# Altium schematic sheet Cyusb3014 - 1.SchDoc
size A3
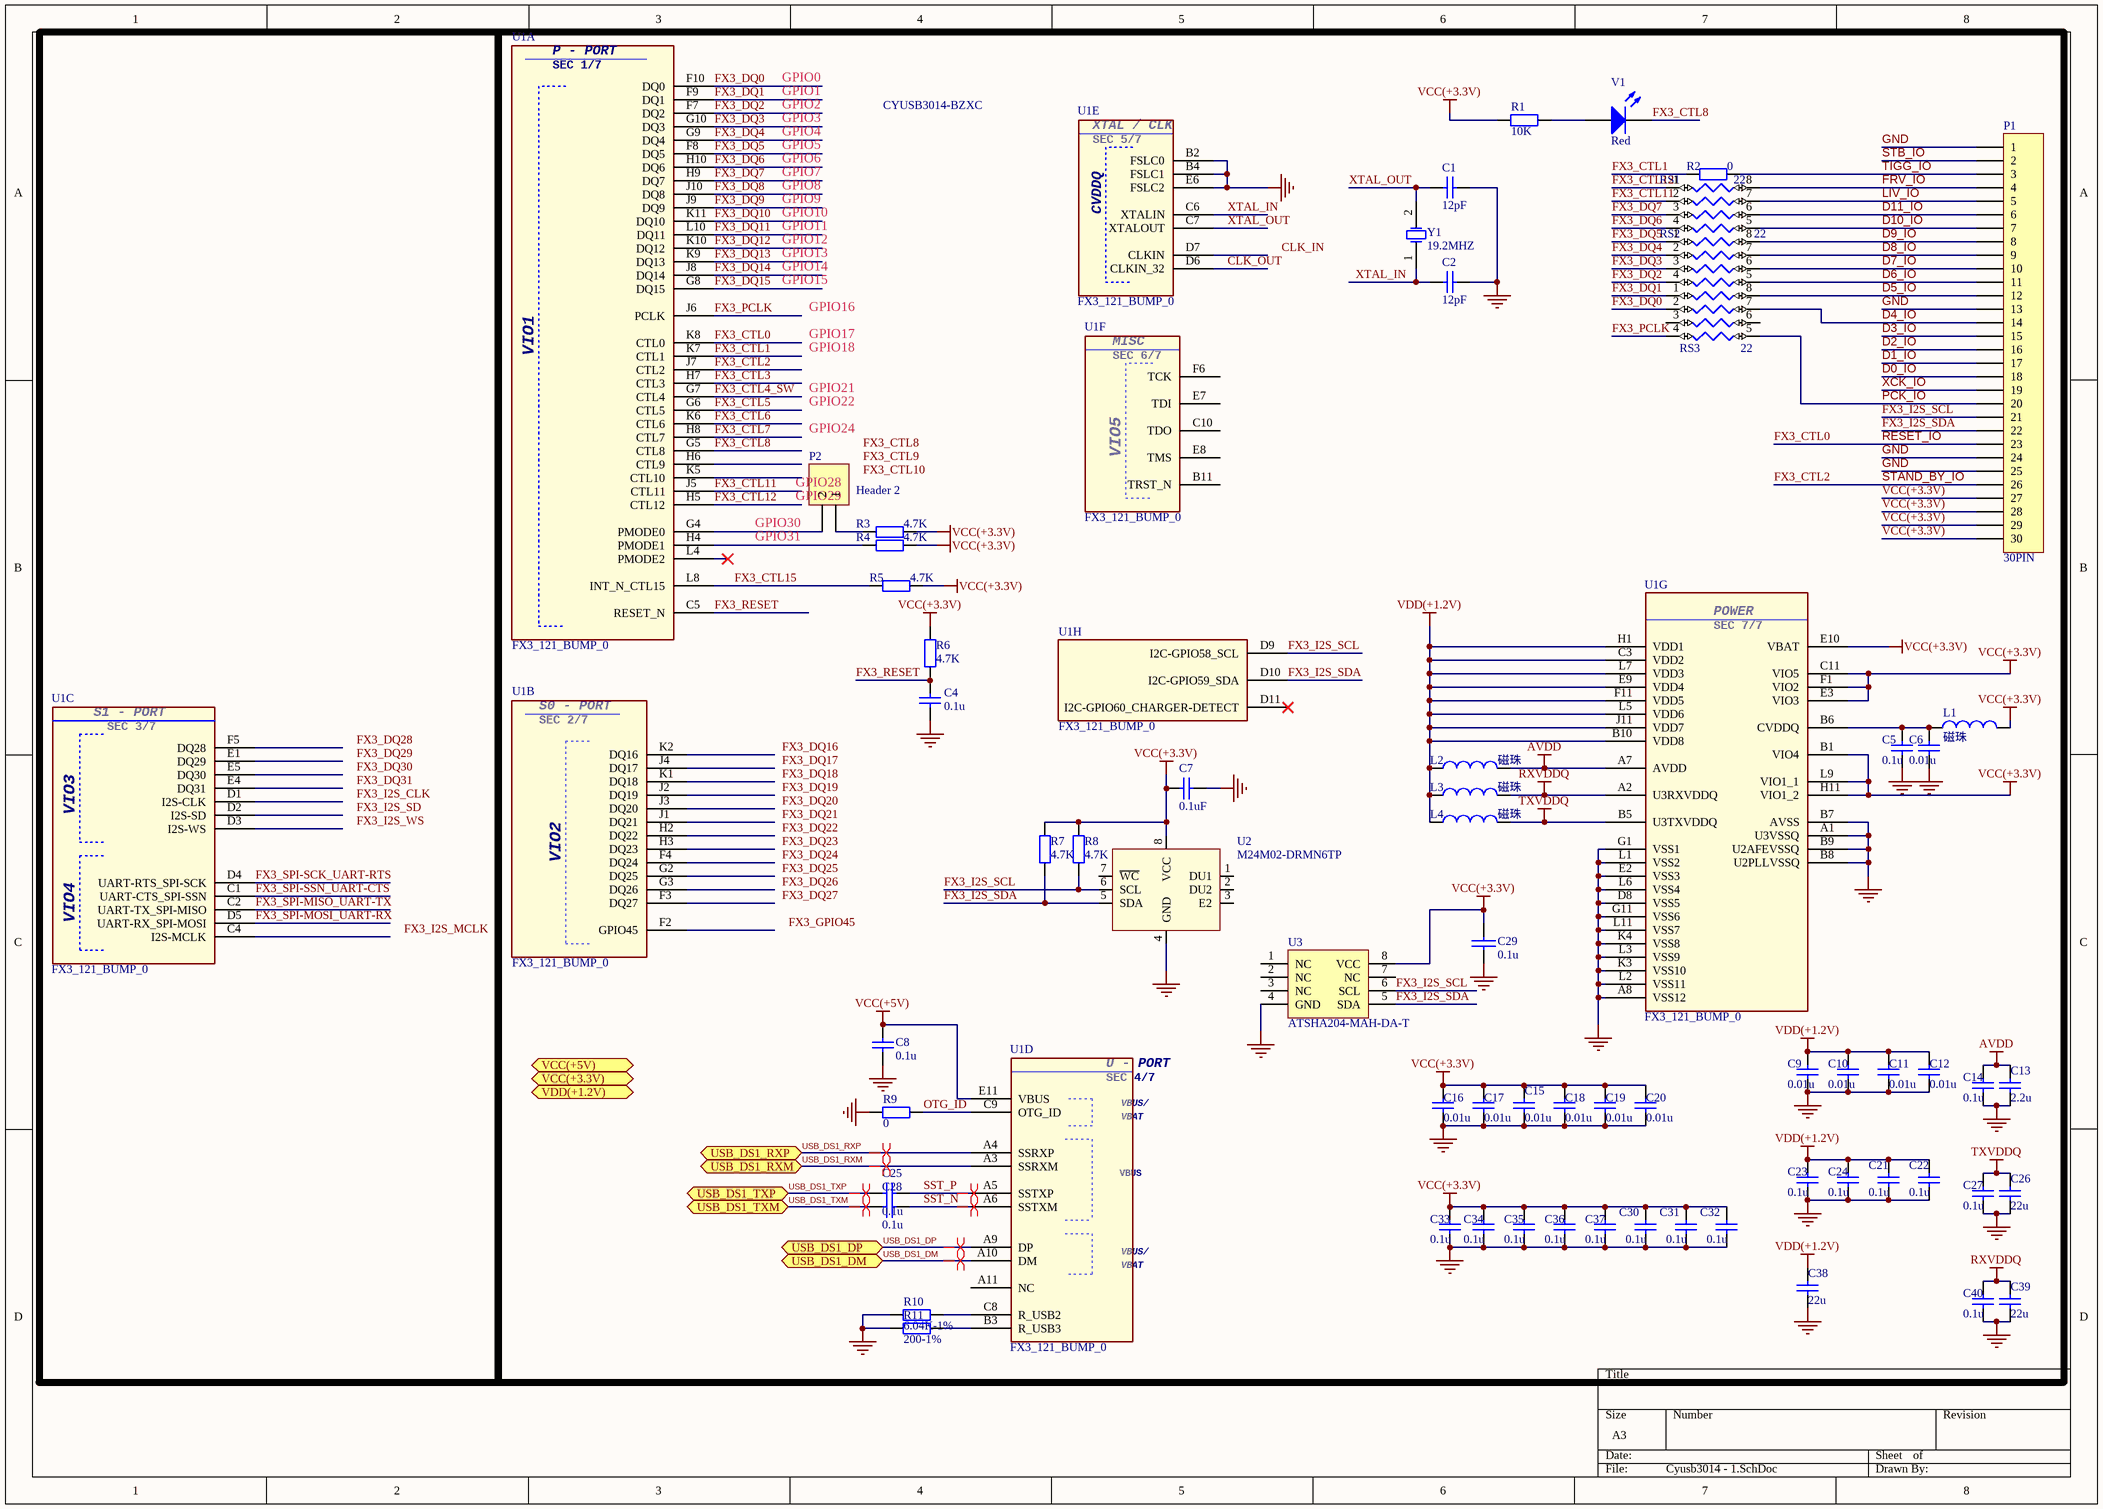
[diagram p0: Cyusb3014 - 1.SchDoc]

## Parts
C1  12pF  [0603S-CAP]
C2  12pF  [0603S-CAP]
C4  0.1u  [0603S-CAP]
C5  0.1u  [C0402]
C6  0.01u  [C0402]
C7  0.1uF  [0603S-CAP]
C8  0.1u  [C0402]
C9  0.01u  [C0402]
C10  0.01u  [C0402]
C11  0.01u  [C0402]
C12  0.01u  [C0402]
C13  2.2u  [C0805S-CAP]
C14  0.1u  [C0402]
C15  0.01u  [C0402]
C16  0.01u  [C0402]
C17  0.01u  [C0402]
C18  0.01u  [C0402]
C19  0.01u  [C0402]
C20  0.01u  [C0402]
C21  0.1u  [C0402]
C22  0.1u  [C0402]
C23  0.1u  [C0402]
C24  0.1u  [C0402]
C25  0.1u  [C0402]
C26  22u  [C0805S-CAP]
C27  0.1u  [C0402]
C28  0.1u  [C0402]
C29  0.1u  [0603S-CAP]
C30  0.1u  [C0402]
C31  0.1u  [C0402]
C32  0.1u  [C0402]
C33  0.1u  [C0402]
C34  0.1u  [C0402]
C35  0.1u  [C0402]
C36  0.1u  [C0402]
C37  0.1u  [C0402]
C38  22u  [C0805S-CAP]
C39  22u  [C0805S-CAP]
C40  0.1u  [C0402]
L1  磁珠  [L0603]
L2  磁珠  [L0603]
L3  磁珠  [L0603]
L4  磁珠  [L0603]
P1  30PIN  [FH12-30S-0.5SH]
P2  Header 2  [HDR1X2]
R1  10K  [0603S-RES]
R2  0  [0603S-RES]
R3  4.7K  [0603S-RES]
R4  4.7K  [0603S-RES]
R5  4.7K  [0603S-RES]
R6  4.7K  [0603S-RES]
R7  4.7K  [0603S-RES]
R8  4.7K  [0603S-RES]
R9  0  [0603S-RES]
R10  6.04K-1%  [0603S-RES]
R11  200-1%  [0603S-RES]
RS1  22  [NC06-4]
RS2  22  [NC06-4]
RS3  22  [NC06-4]
U1  FX3_121_BUMP_0  [121_BGA_FX3]  (parts A,B,C,D,E,F,G,H of 8)
U2  M24M02-DRMN6TP  [SOIC127P600X175-8N]
U3  ATSHA204-MAH-DA-T  [UDFN]
V1  Red  [LED0805S]
Y1  19.2MHZ  [爱普生晶振3.2×2.5MM - 无源]

## Ports
USB_DS1_DM (bidir), USB_DS1_DP (bidir), USB_DS1_RXM (bidir), USB_DS1_RXP (bidir), USB_DS1_TXM (bidir), USB_DS1_TXP (bidir), VCC(+3.3V) (bidir), VCC(+5V) (bidir), VDD(+1.2V) (bidir)

## Nets
AVDD: C13.2 C14.1 L2.2 U1.A7(AVDD)
GND: C1.1 C2.1 C4.1 C5.2 C6.2 C7.1 C8.2 C9.2 C10.2 C11.2 C12.2 C13.1 C14.2 C15.2 C16.2 C17.2 C18.2 C19.2 C20.2 C21.2 C22.2 C23.2 C24.2 C26.1 C27.2 C29.2 C30.2 C31.2 C32.2 C33.2 C34.2 C35.2 C36.2 C37.2 C38.1 C39.1 C40.2 P1.1 P1.13 P1.24 P1.25 R9.2 R10.2 R11.2 U1.A1(U3VSSQ) U1.A8(VSS12) U1.B2(FSLC0) U1.B4(FSLC1) U1.B7(AVSS) U1.B8(U2PLLVSSQ) U1.B9(U2AFEVSSQ) U1.D8(VSS5) U1.E2(VSS3) U1.E6(FSLC2) U1.G1(VSS1) U1.G11(VSS6) U1.K3(VSS10) U1.K4(VSS8) U1.L1(VSS2) U1.L2(VSS11) U1.L3(VSS9) U1.L6(VSS4) U1.L11(VSS7) U2.4(GND) U3.4(GND)
RXVDDQ: C39.2 C40.1 L3.2 U1.A2(U3RXVDDQ)
TXVDDQ: C26.2 C27.1 L4.2 U1.B5(U3TXVDDQ)
VCC(+3.3V): C7.2 C15.1 C16.1 C17.1 C18.1 C19.1 C20.1 C29.1 C30.1 C31.1 C32.1 C33.1 C34.1 C35.1 C36.1 C37.1 L1.2 P1.27 P1.28 P1.29 P1.30 R1.2 R3.2 R4.2 R5.1 R6.1 R7.2 R8.2 U1.B1(VIO4) U1.C11(VIO5) U1.E3(VIO3) U1.E10(VBAT) U1.F1(VIO2) U1.H11(VIO1_2) U1.L9(VIO1_1) U2.8(VCC) U3.8(VCC)
VCC(+5V): C8.1 U1.E11(VBUS)
VDD(+1.2V): C9.1 C10.1 C11.1 C12.1 C21.1 C22.1 C23.1 C24.1 C38.2 L2.1 L3.1 L4.1 U1.B10(VDD8) U1.C3(VDD2) U1.E9(VDD4) U1.F11(VDD5) U1.H1(VDD1) U1.J11(VDD7) U1.L5(VDD6) U1.L7(VDD3)
CLK_OUT: U1.D6(CLKIN_32)
D0_IO: P1.18
D1_IO: P1.17
D2_IO: P1.16
D3_IO: P1.15
D4_IO: P1.14 RS3.7
D5_IO: P1.12 RS3.8
D6_IO: P1.11 RS2.5
D7_IO: P1.10 RS2.6
D8_IO: P1.9 RS2.7
D9_IO: P1.8 RS2.8
D10_IO: P1.7 RS1.5
D11_IO: P1.6 RS1.6
FRV_IO: P1.4 RS1.8
FX3_CTL0: P1.23 U1.K8(CTL0)  [also labelled RESET_IO]
FX3_CTL1: R2.2 U1.K7(CTL1)
FX3_CTL2: P1.26 U1.J7(CTL2)  [also labelled STAND_BY_IO]
FX3_CTL3: U1.H7(CTL3)
FX3_CTL4_SW: U1.G7(CTL4)
FX3_CTL5: U1.G6(CTL5)
FX3_CTL6: U1.K6(CTL6)
FX3_CTL7: U1.H8(CTL7)
FX3_CTL8: U1.G5(CTL8) V1.2(K)
FX3_CTL11: RS1.2 U1.J5(CTL11)
FX3_CTL12: RS1.1 U1.H5(CTL12)
FX3_CTL15: R5.2 U1.L8(INT_N_CTL15)
FX3_DQ0: RS3.2 U1.F10(DQ0)
FX3_DQ1: RS3.1 U1.F9(DQ1)
FX3_DQ2: RS2.4 U1.F7(DQ2)
FX3_DQ3: RS2.3 U1.G10(DQ3)
FX3_DQ4: RS2.2 U1.G9(DQ4)
FX3_DQ5: RS2.1 U1.F8(DQ5)
FX3_DQ6: RS1.4 U1.H10(DQ6)
FX3_DQ7: RS1.3 U1.H9(DQ7)
FX3_DQ8: U1.J10(DQ8)
FX3_DQ9: U1.J9(DQ9)
FX3_DQ10: U1.K11(DQ10)
FX3_DQ11: U1.L10(DQ11)
FX3_DQ12: U1.K10(DQ12)
FX3_DQ13: U1.K9(DQ13)
FX3_DQ14: U1.J8(DQ14)
FX3_DQ15: U1.G8(DQ15)
FX3_I2S_SCL: P1.21 R8.1 U1.D9(I2C-GPIO58_SCL) U2.6(SCL) U3.6(SCL)
FX3_I2S_SDA: P1.22 R7.1 U1.D10(I2C-GPIO59_SDA) U2.5(SDA) U3.5(SDA)
FX3_PCLK: RS3.4 U1.J6(PCLK)
FX3_RESET: C4.2 R6.2 U1.C5(RESET_N)
FX3_SPI-MISO_UART-TX: U1.C2(UART-TX_SPI-MISO)
FX3_SPI-MOSI_UART-RX: U1.D5(UART-RX_SPI-MOSI)
FX3_SPI-SCK_UART-RTS: U1.D4(UART-RTS_SPI-SCK)
FX3_SPI-SSN_UART-CTS: U1.C1(UART-CTS_SPI-SSN)
LIV_IO: P1.5 RS1.7
OTG_ID: R9.1 U1.C9(OTG_ID)
PCK_IO: P1.20 RS3.5
SST_N: C28.2 U1.A6(SSTXM)
SST_P: C25.2 U1.A5(SSTXP)
STB_IO: P1.2
TIGG_IO: P1.3 R2.1
USB_DS1_DM: U1.A10(DM) ; port USB_DS1_DM
USB_DS1_DP: U1.A9(DP) ; port USB_DS1_DP
USB_DS1_RXM: U1.A3(SSRXM) ; port USB_DS1_RXM
USB_DS1_RXP: U1.A4(SSRXP) ; port USB_DS1_RXP
USB_DS1_TXM: C28.1 ; port USB_DS1_TXM
USB_DS1_TXP: C25.1 ; port USB_DS1_TXP
XCK_IO: P1.19
XTAL_IN: C2.2 U1.C6(XTALIN) Y1.1(OSC1)
XTAL_OUT: C1.2 U1.C7(XTALOUT) Y1.2(OSC2)
NetC5_1: C5.1 C6.1 L1.1 U1.B6(CVDDQ)
NetP2_1: P2.1 R3.1
NetP2_2: P2.2 U1.G4(PMODE0)
NetR1_1: R1.1 V1.1(A)
NetR4_1: R4.1 U1.H4(PMODE1)
NetR10_1: R10.1 U1.C8(R_USB2)
NetR11_1: R11.1 U1.B3(R_USB3)

Not connected (* = marked no-connect by the designer): RS3 3 6; U1 A11(NC) B11(TRST_N) C4(I2S-MCLK) C10(TDO) D1(I2S-CLK) D2(I2S-SD) D3(I2S-WS) D7(CLKIN) D11(I2C-GPIO60_CHARGER-DETECT)* E1(DQ29) E4(DQ31) E5(DQ30) E7(TDI) E8(TMS) F2(GPIO45) F3(DQ27) F4(DQ24) F5(DQ28) F6(TCK) G2(DQ25) G3(DQ26) H2(DQ22) H3(DQ23) H6(CTL9) J1(DQ21) J2(DQ19) J3(DQ20) J4(DQ17) K1(DQ18) K2(DQ16) K5(CTL10) L4(PMODE2)*; U2 1(DU1) 2(DU2) 3(E2) 7(~{WC}); U3 1(NC) 2(NC) 3(NC) 7(NC)

## Layout directives
differential pair: SST_N, SST_P, USB_DS1_DM, USB_DS1_DP, USB_DS1_RXM, USB_DS1_RXP, USB_DS1_TXM, USB_DS1_TXP

## Notes on the sheet
- GPIO0
- GPIO1
- GPIO2
- CYUSB3014-BZXC
- GPIO3
- GPIO4
- GPIO5
- GPIO6
- GPIO7
- GPIO8
- GPIO9
- GPIO10
- GPIO11
- GPIO12
- GPIO13
- GPIO14
- GPIO15
- GPIO16
- GPIO17
- GPIO18
- GPIO21
- GPIO22
- GPIO24
- (near P2) GPIO28
- (near P2) GPIO29
- (near P2) GPIO30
- (near P2) GPIO31
- Labels drawn without touching a wire or pin: CLK_IN, FX3_CTL8, FX3_CTL9, FX3_CTL10, FX3_DQ16, FX3_DQ17, FX3_DQ18, FX3_DQ19, FX3_DQ20, FX3_DQ21, FX3_DQ22, FX3_DQ23, FX3_DQ24, FX3_DQ25, FX3_DQ26, FX3_DQ27, FX3_DQ28, FX3_DQ29, FX3_DQ30, FX3_DQ31, FX3_GPIO45, FX3_I2S_CLK, FX3_I2S_MCLK, FX3_I2S_SD, FX3_I2S_WS
- (in symbol FX3_121_BUMP_0, part A) P - PORT; SEC 1/7; VIO1
- (in symbol FX3_121_BUMP_0, part B) S0 - PORT; SEC 2/7
- (in symbol FX3_121_BUMP_0, part C) S1 - PORT; SEC 3/7
- (in symbol FX3_121_BUMP_0, part D) U - PORT; SEC 4/7; VBUS/
- (in symbol FX3_121_BUMP_0, part E) XTAL / CLK; SEC 5/7
- (in symbol FX3_121_BUMP_0, part F) MISC; SEC 6/7
- (in symbol FX3_121_BUMP_0, part G) POWER; SEC 7/7

## Library data of the parts
C1 C2 = CAP CER SMT 4.3pF 0805: 2. Manufacturere Part Number: C0805C439D5GACTU; 1. Manufacturer: Kemet; 8. Alternate Part: any; 7. Package / Case: 0805; 0. Do Not Install: DNI; 6. Mounting Type: SMT; 5. Supplier Link: http://www.digikey.com/product-detail/en/C0805C439D5GACTU/C0805C439D5GACTU-ND/2212763; 3. Supplier: Digi-Key; 4. Supplier Part Number: C0805C439D5GACTU-ND
C4 = Cap: 50V/8.2u/0805; Value: 100n; Published: 8-Jun-2000; LatestRevisionDate: 17-Jul-2002; LatestRevisionNote: Re-released for DXP Platform.; PackageReference: RAD-0.3; Publisher: Altium Limited
C5 C6 C8-C28 C30-C40 = CAP0805: Capacitor; Value: 104; Published: 8-Jun-2000; Revision: July-2002: Re-released for DXP Platform.; Publisher: Altium Limited
C7 = CAP SMT 0.1uF 16V X7R: 2. Manufacturere Part Number: C0805C104K4RACTU; 1. Manufacturer: Kemet; 8. Alternate Part: any; 7. Package / Case: 0805; 6. Mounting Type: SMT; 5. Supplier Link: http://www.digikey.com/product-detail/en/C0805C104K4RACTU/399-1167-1-ND/411442; 3. Supplier: Digi-Key; 4. Supplier Part Number: 399-1167-1-ND
C29 = CAP: RC=1206
L1-L4 = Inductor: Code_IEC: 1005; Value: 10mH; Published: 8-Jun-2000; LatestRevisionDate: 29-May-2009; LatestRevisionNote: IPC-7351 Footprint Added.; PackageReference: 0402-A; Publisher: Altium Limited; PackageDescription: Chip Inductor; Code_JEITA: 0402
P1 = Header 30: Header, 30-Pin; LatestRevisionDate: 17-Jul-2002; LatestRevisionNote: Re-released for DXP Platform.; Publisher: Altium Limited
P2 = Header 2: Header, 2-Pin; LatestRevisionDate: 17-Jul-2002; LatestRevisionNote: Re-released for DXP Platform.; Publisher: Altium Limited
R1 = Res2: Resistor; Published: 8-Jun-2000; LatestRevisionDate: 17-Jul-2002; LatestRevisionNote: Re-released for DXP Platform.; PackageReference: AXIAL-0.4; Publisher: Altium Limited; Value: 10K
R2-R11 = Res2: Resistor; Value: 10K; Published: 8-Jun-2000; LatestRevisionDate: 17-Jul-2002; LatestRevisionNote: Re-released for DXP Platform.; PackageReference: AXIAL-0.4; Publisher: Altium Limited
RS1-RS3 = RN4: Option 2 - Device: *; Option 2 - Spec: *; Option 3 - Device: *; Option 3 - Spec: *; Option 4 - Device: *; Option 4 - Spec: *; Option 5 - Device: *; Option 5 - Spec: *; Option 6 - Device: *; Option 6 - Spec: *; Option 7 - Device: *; Option 7 - Spec: *; Option 8 - Device: *; Option 8 - Spec: *
U2 = 24LC64-I/SN: IC EEPROM 64KBIT 400KHZ 8SOIC; Manufacturer: Microchip Technology; Format - Memory: EEPROMs - Serial; Memory Size: 64K (8K x 8); Interface: I2C, 2-Wire Serial; Voltage - Supply: 2.5 V ~ 5.5 V; Supplier 1: Digi-Key; Manufacturer Part Number: 24LC64-I/SN; RoHS: RoHS Compliant; Category: Integrated Circuits (ICs); Stock 1: 16323; Pricing 1: 1=0.38, 25=0.37, 100=0.35 (USD); Packaging: Tube; Memory Type: EEPROM; Speed: 400kHz; Operating Temperature: -40°C ~ 85°C (TA); Package / Case: 8-SOIC (0.154", 3.90mm Width); Supplier Device Package: 8-SOIC; ComponentLink1URL: http://www.microchip.com/mymicrochip/filehandler.aspx?ddocname=en011843; ComponentLink1Description: http://www.microchip.com/mymicrochip/filehandler.aspx?ddocname=en011843; Supplier Part Number 1: 24LC64-I/SN-ND
U3 = AT24C128
V1 = LED0: Typical INFRARED GaAs LED; Published: 8-Jun-2000; LatestRevisionDate: 08-Jul-2005; LatestRevisionNote: Mech Layer 1 removed.; PackageReference: LED-0; Publisher: Altium Limited
Y1 = XTAL 32.768KHZ: Crystal, CRYSTAL 32.768KHZ 6PF SMD; 2. Manufacturere Part Number: ABS07-120-32.768KHZ-T; 1. Manufacturer: Abracon; 6. Mounting Type: SMT; 9. Notes: 2 pad - Abracon ABS07-120-32.768KHZ-T, 4 pad - Abracon ABS25-32.768KHZ-6-T; 0. Do Not Install: DNI; 5. Supplier Link: http://www.digikey.com/product-detail/en/ABS07-120-32.768KHZ-T/535-11937-1-ND/3724046; 3. Supplier: Digi-Key; 4. Supplier Part Number: 535-11937-1-ND